# EAGLE schematic ScanMasterVCI (EAGLE 8.4.3)

## Sheet 1 of 2: IC, Power, Connectors
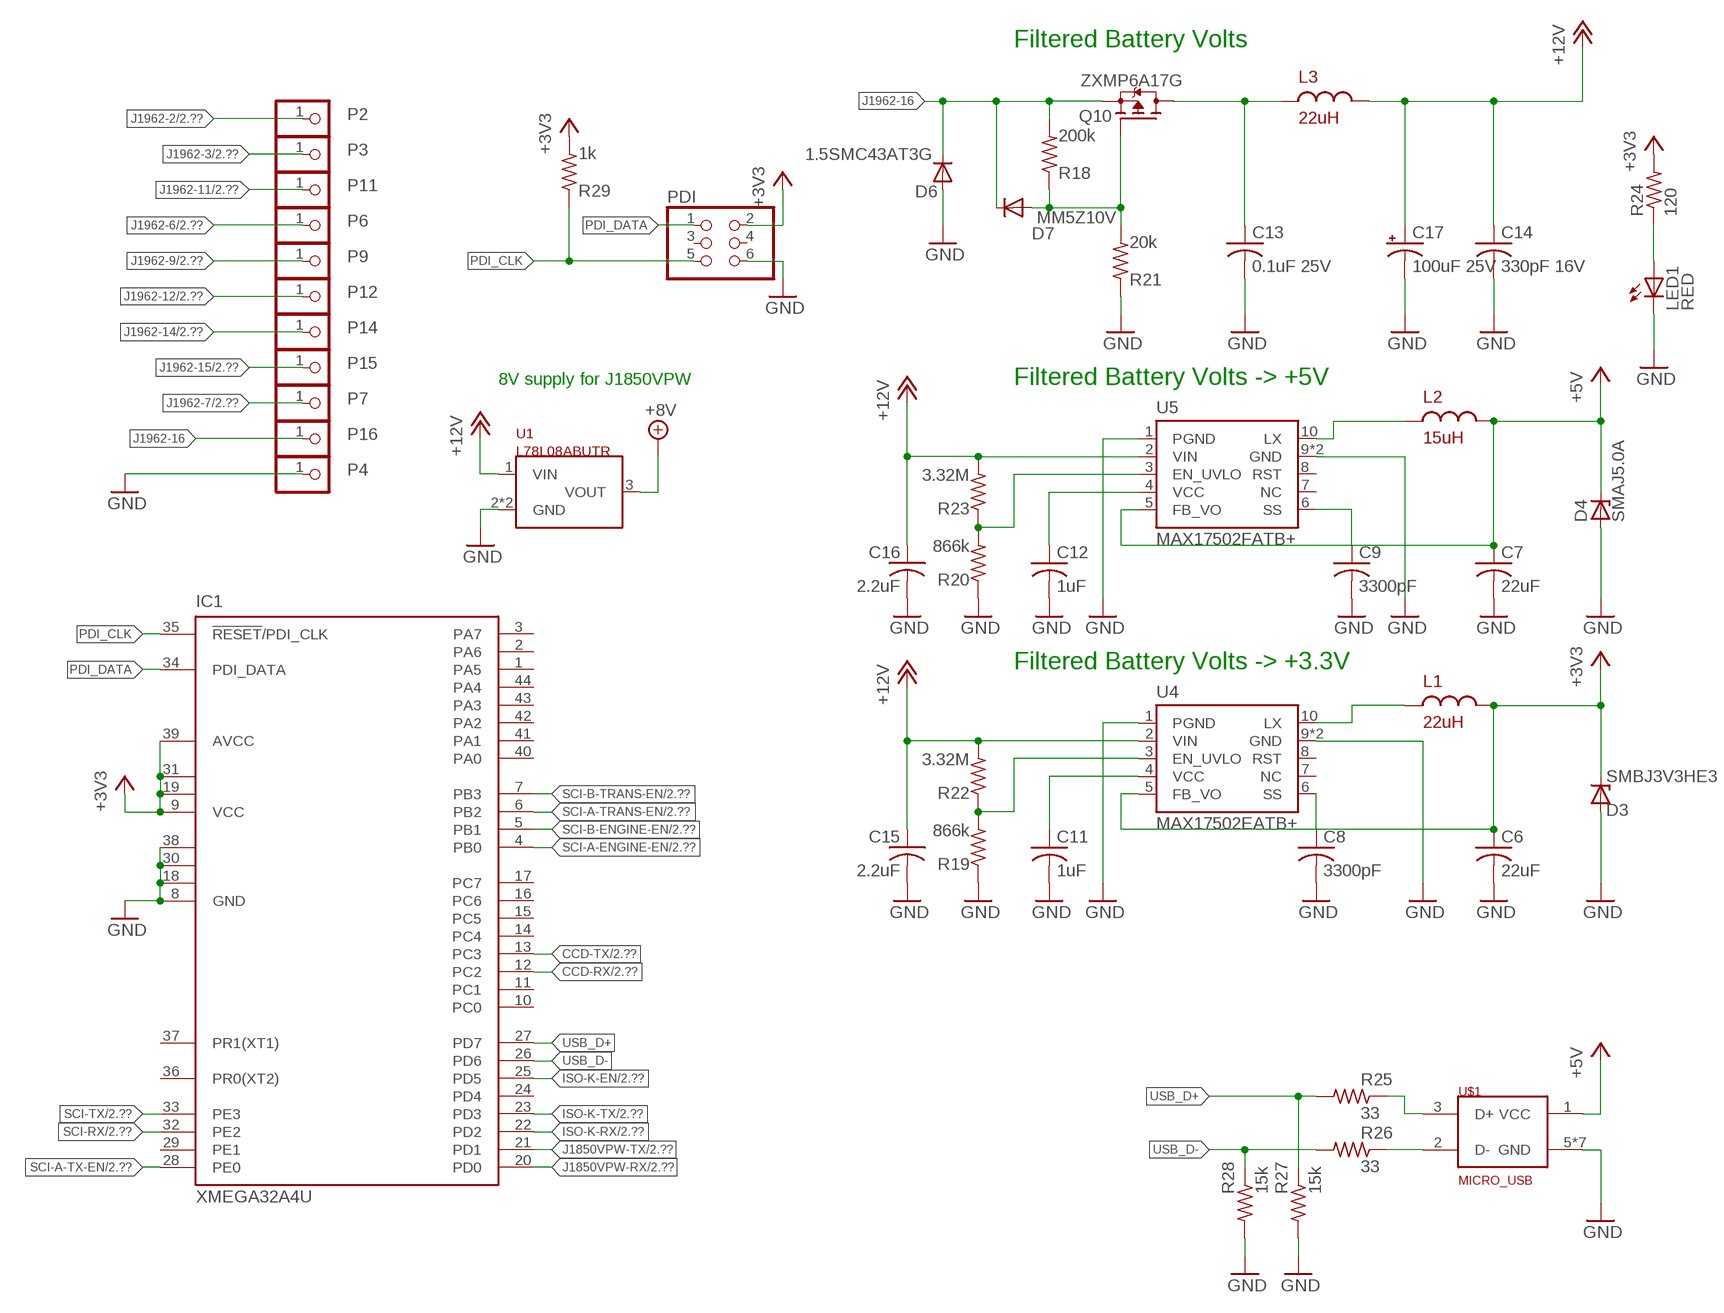
[diagram p0: schematic, sheet 1]

### Parts
C6  22uF  C-USC0603  [C0603]
C7  22uF  C-USC0603  [C0603]
C8  3300pF  C-USC0603  [C0603]
C9  3300pF  C-USC0603  [C0603]
C11  1uF  C-USC0603  [C0603]
C12  1uF  C-USC0603  [C0603]
C13  0.1uF 25V  C-USC0603  [C0603]
C14  330pF 16V  C-USC0603  [C0603]
C15  2.2uF  C-USC0603  [C0603]
C16  2.2uF  C-USC0603  [C0603]
C17  100uF 25V  100UF-POLAR-RADIAL-2.5MM-25V-20%  [CPOL-RADIAL-2.5MM-6.5MM]
D3  SMBJ3V3HE3  ZENER-DIODESMB  [SMB]
D4  SMAJ5.0A  ZENER-DIODESMB  [SMB]
D6  1.5SMC43AT3G  DIODE-SMC  [SMC]
D7  MM5Z10V  DIODE-SOD523  [SOD523]
IC1  XMEGA32A4U  XMEGA16A4A  [TQFP44]
L1  22uH  INDUCTOR  [L0603]
L2  15uH  INDUCTOR  [L0603]
L3  22uH  INDUCTOR  [L0603]
LED1  RED  LEDCHIP-LED0603  [CHIP-LED0603]
P2  PINHD-1X1  [1X01]
P3  PINHD-1X1  [1X01]
P4  PINHD-1X1  [1X01]
P6  PINHD-1X1  [1X01]
P7  PINHD-1X1  [1X01]
P9  PINHD-1X1  [1X01]
P11  PINHD-1X1  [1X01]
P12  PINHD-1X1  [1X01]
P14  PINHD-1X1  [1X01]
P15  PINHD-1X1  [1X01]
P16  PINHD-1X1  [1X01]
PDI  PINHD-2X3  [2X03]
Q10  ZXMP6A17G  [SOT223]
R18  200k  R-US_R0603  [R0603]
R19  866k  R-US_R0603  [R0603]
R20  866k  R-US_R0603  [R0603]
R21  20k  R-US_R0603  [R0603]
R22  3.32M  R-US_R0603  [R0603]
R23  3.32M  R-US_R0603  [R0603]
R24  120  R-US_R0603  [R0603]
R25  33  R-US_R0603  [R0603]
R26  33  R-US_R0603  [R0603]
R27  15k  R-US_R0603  [R0603]
R28  15k  R-US_R0603  [R0603]
R29  1k  R-US_R0603  [R0603]
U1  L78L08ABUTR  L78L  [SOT89]
U4  MAX17502EATB+  MAX17502  [TDFN-10-EP]
U5  MAX17502FATB+  MAX17502  [TDFN-10-EP]
U$1  MICRO_USB  [10118192]

### Nets
+3V3 [+3.3v]: C6.1 D3.C IC1.9(VCC) IC1.19(VCC1) IC1.31(VCC2) IC1.39(AVCC) L1.2 PDI.2 R24.2 R29.2 U4.5(FB_VO) ; also sheet 2
+5V [+5v]: C7.1 D4.C L2.2 U5.5(FB_VO) U$1.1(VCC) ; also sheet 2
+8V [+3.3v]: U1.3(VOUT) ; also sheet 2
+12V [+12v]: C14.1 C15.1 C16.1 C17.1(+) L3.2 R22.2 R23.2 U1.1(VIN) U4.2(VIN) U5.2(VIN) ; also sheet 2
CCD-RX: IC1.12(PC2) ; also sheet 2
CCD-TX: IC1.13(PC3) ; also sheet 2
GND [+12v]: C6.2 C7.2 C8.2 C9.2 C11.2 C12.2 C13.2 C14.2 C15.2 C16.2 C17.2(-) D3.A D4.A D6.A IC1.8(GND) IC1.18(GND1) IC1.30(GND2) IC1.38(GND3) LED1.C P4.1 PDI.6 R19.1 R20.1 R21.1 R27.2 R28.2 U1.2(GND) U1.2@1(GND) U4.1(PGND) U4.9(GND) U4.EPAD(GND) U5.1(PGND) U5.9(GND) U5.EPAD(GND) U$1.5(GND) U$1.M1(GND) U$1.M2(GND) U$1.M3(GND) U$1.M4(GND) U$1.M5(GND) U$1.M6(GND) ; also sheet 2
ISO-K-EN: IC1.25(PD5) ; also sheet 2
ISO-K-RX: IC1.22(PD2) ; also sheet 2
ISO-K-TX: IC1.23(PD3) ; also sheet 2
J1850VPW-RX: IC1.20(PD0) ; also sheet 2
J1850VPW-TX: IC1.21(PD1) ; also sheet 2
J1962-2: P2.1 ; also sheet 2
J1962-3: P3.1 ; also sheet 2
J1962-6: P6.1 ; also sheet 2
J1962-7: P7.1 ; also sheet 2
J1962-9: P9.1 ; also sheet 2
J1962-11: P11.1 ; also sheet 2
J1962-12: P12.1 ; also sheet 2
J1962-14: P14.1 ; also sheet 2
J1962-15: P15.1 ; also sheet 2
J1962-16 [+12v]: D6.C D7.C P16.1 Q10.3(S) R18.2
N$2: LED1.A R24.1
N$3: C8.1 U4.6(SS)
N$7: R19.2 R22.1 U4.3(EN_UVLO)
N$9: C11.1 U4.4(VCC)
N$12 [+3.3v]: L1.1 U4.10(LX)
N$15: C12.1 U5.4(VCC)
N$16: R20.2 R23.1 U5.3(EN_UVLO)
N$17: C9.1 U5.6(SS)
N$18 [+12v]: C13.1 L3.1 Q10.2(D) Q10.4(D)
N$19 [+5v]: L2.1 U5.10(LX)
N$20 [+12v]: D7.A Q10.1(G) R18.1 R21.2
N$24: R25.1 U$1.3(D+)
N$25: R26.1 U$1.2(D-)
PDI_CLK: IC1.35(!RESET!/PDI_CLK) PDI.5 R29.1
PDI_DATA: IC1.34(PDI_DATA) PDI.1
SCI-A-ENGINE-EN: IC1.4(PB0) ; also sheet 2
SCI-A-TRANS-EN: IC1.6(PB2) ; also sheet 2
SCI-A-TX-EN: IC1.28(PE0) ; also sheet 2
SCI-B-ENGINE-EN: IC1.5(PB1) ; also sheet 2
SCI-B-TRANS-EN: IC1.7(PB3) ; also sheet 2
SCI-RX: IC1.32(PE2) ; also sheet 2
SCI-TX: IC1.33(PE3) ; also sheet 2
USB_D+: IC1.27(PD7) R25.2 R27.1
USB_D-: IC1.26(PD6) R26.2 R28.1
Unconnected: IC1.1(PA5) IC1.2(PA6) IC1.3(PA7) IC1.10(PC0) IC1.11(PC1) IC1.14(PC4) IC1.15(PC5) IC1.16(PC6) IC1.17(PC7) IC1.24(PD4) IC1.29(PE1) IC1.36(PR0(XT2)) IC1.37(PR1(XT1)) IC1.40(PA0) IC1.41(PA1) IC1.42(PA2) IC1.43(PA3) IC1.44(PA4) PDI.3 PDI.4 U4.7(NC) U4.8(RST) U5.7(NC) U5.8(RST)

### Notes on the sheet
- Filtered Battery Volts
- 8V supply for J1850VPW | Filtered Battery Volts -> +5V
- Filtered Battery Volts -> +3.3V

## Sheet 2 of 2: Bus Connections, Mux
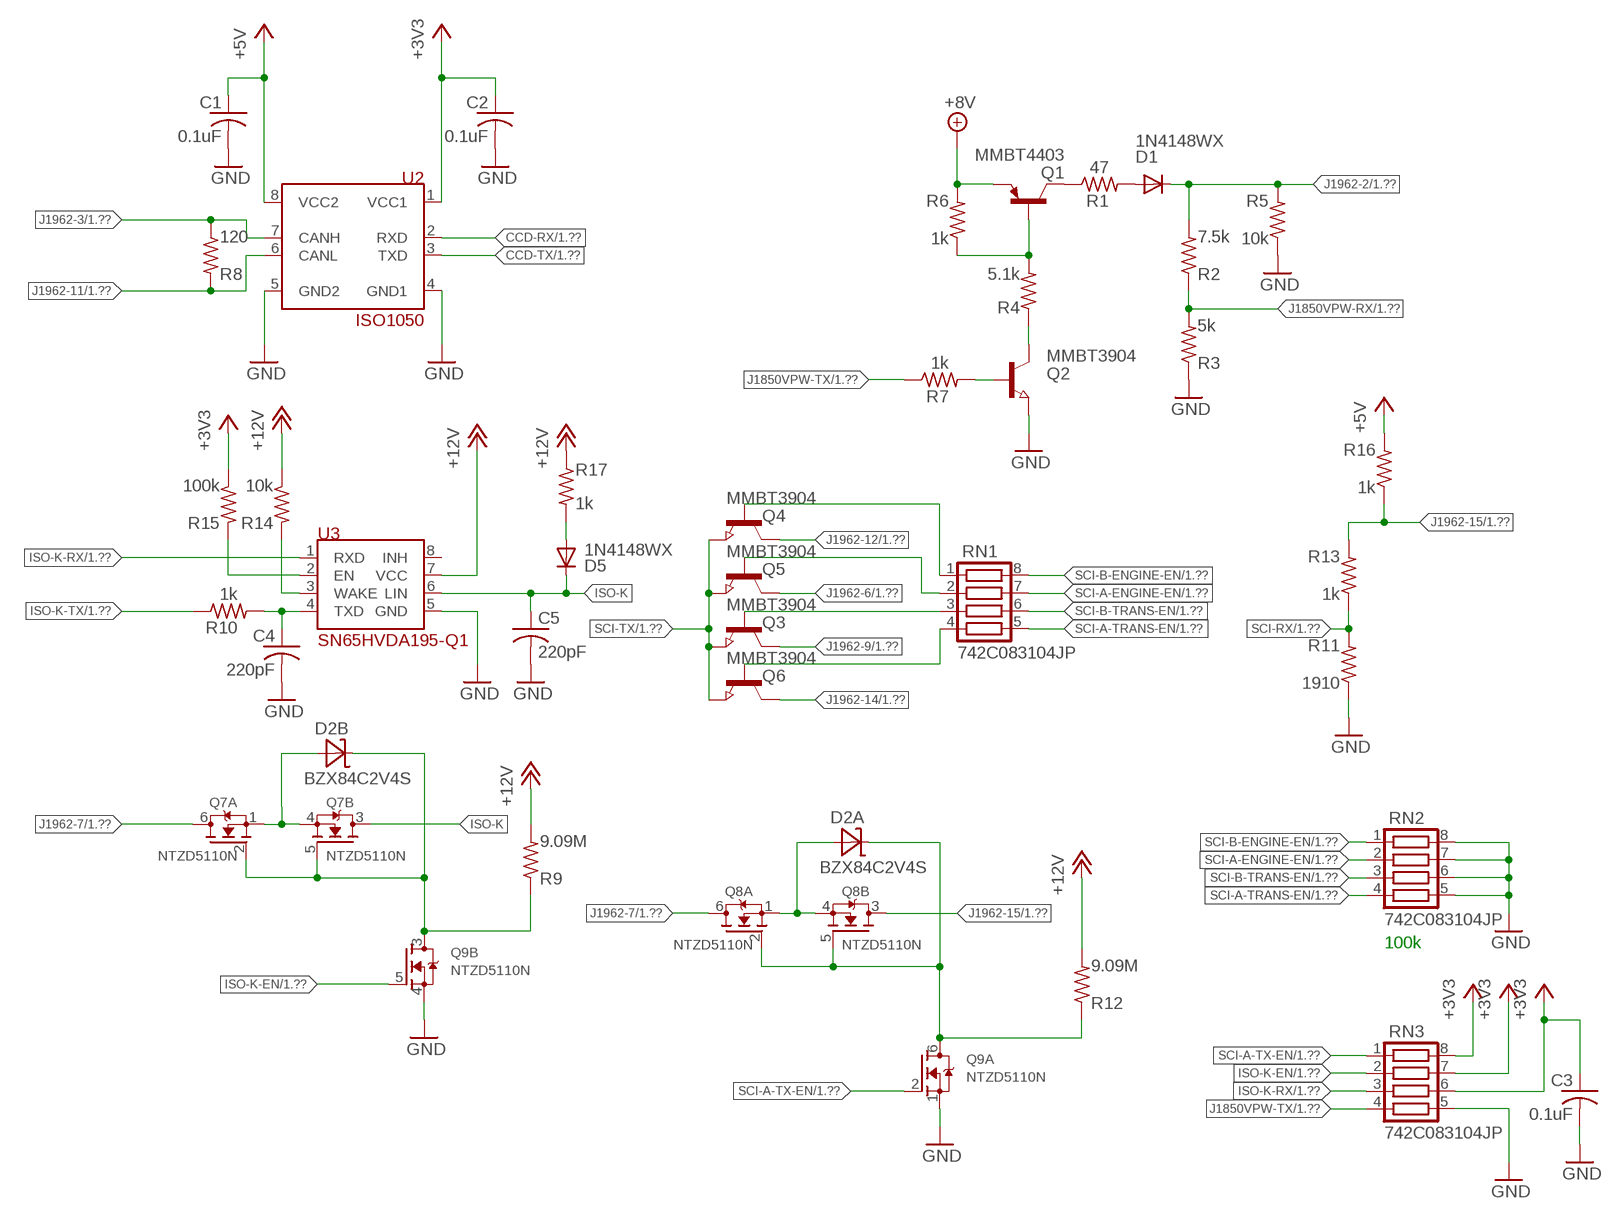
[diagram p1: schematic, sheet 2]

### Parts
C1  0.1uF  C-USC0603  [C0603]
C2  0.1uF  C-USC0603  [C0603]
C3  0.1uF  C-USC0603  [C0603]
C4  220pF  C-USC0603  [C0603]
C5  220pF  C-USC0603  [C0603]
D1  1N4148WX  DIODE-SOD323-R  [SOD323-R]
D2  BZX84C2V4S  [SOT363]
D5  1N4148WX  DIODE-SOD323-R  [SOD323-R]
Q1  MMBT4403  MMBT4403LT1SMD  [SOT23-BEC]
Q2  MMBT3904  NPN-TRANSISTOR_SOT23  [SOT23]
Q3  MMBT3904  NPN-TRANSISTOR_SOT23  [SOT23]
Q4  MMBT3904  NPN-TRANSISTOR_SOT23  [SOT23]
Q5  MMBT3904  NPN-TRANSISTOR_SOT23  [SOT23]
Q6  MMBT3904  NPN-TRANSISTOR_SOT23  [SOT23]
Q7  NTZD5110N  [SOT563]
Q8  NTZD5110N  [SOT563]
Q9  NTZD5110N  [SOT563]
R1  47  R-US_R0603  [R0603]
R2  7.5k  R-US_R0603  [R0603]
R3  5k  R-US_R0603  [R0603]
R4  5.1k  R-US_R0603  [R0603]
R5  10k  R-US_R0603  [R0603]
R6  1k  R-US_R0603  [R0603]
R7  1k  R-US_R0603  [R0603]
R8  120  R-US_R0603  [R0603]
R9  9.09M  R-US_R0603  [R0603]
R10  1k  R-US_R0603  [R0603]
R11  1910  R-US_R0603  [R0603]
R12  9.09M  R-US_R0603  [R0603]
R13  1k  R-US_R0603  [R0603]
R14  10k  R-US_R0603  [R0603]
R15  100k  R-US_R0603  [R0603]
R16  1k  R-US_R0603  [R0603]
R17  1k  R-US_R0603  [R0603]
RN1  742C083104JP  CTS742C083  [CTS742C083]
RN2  742C083104JP  CTS742C083  [CTS742C083]
RN3  742C083104JP  CTS742C083  [CTS742C083]
U2  ISO1050  [SOP08]
U3  SN65HVDA195-Q1  [SO08]

### Nets
+3V3 [+3.3v]: C2.1 C3.1 R15.1 RN3.6 RN3.7 RN3.8 U2.1(VCC1) ; also sheet 1
+5V [+5v]: C1.1 R16.2 U2.8(VCC2) ; also sheet 1
+8V [+3.3v]: Q1.E R6.2 ; also sheet 1
+12V [+12v]: R9.2 R12.2 R14.1 R17.1 U3.7(VCC) ; also sheet 1
CCD-RX: U2.2(RXD) ; also sheet 1
CCD-TX: U2.3(TXD) ; also sheet 1
GND [+12v]: C1.2 C2.2 C3.2 C4.2 C5.2 Q2.2(E) Q9.1(A:S) Q9.4(B:S) R3.1 R5.1 R11.1 RN2.5 RN2.6 RN2.7 RN2.8 RN3.5 U2.4(GND1) U2.5(GND2) U3.5(GND) ; also sheet 1
ISO-K: C5.1 D5.C Q7.3(B:D) U3.6(LIN)
ISO-K-EN: Q9.5(B:G) RN3.2 ; also sheet 1
ISO-K-RX: RN3.3 U3.1(RXD) ; also sheet 1
ISO-K-TX: R10.1 ; also sheet 1
J1850VPW-RX: R2.1 R3.2 ; also sheet 1
J1850VPW-TX: R7.1 RN3.4 ; also sheet 1
J1962-2: D1.C R2.2 R5.2 ; also sheet 1
J1962-3: R8.1 U2.7(CANH) ; also sheet 1
J1962-6: Q5.3(C) ; also sheet 1
J1962-7: Q7.6(A:D) Q8.6(A:D) ; also sheet 1
J1962-9: Q3.3(C) ; also sheet 1
J1962-11: R8.2 U2.6(CANL) ; also sheet 1
J1962-12: Q4.3(C) ; also sheet 1
J1962-14: Q6.3(C) ; also sheet 1
J1962-15: Q8.3(B:D) R13.2 R16.1 ; also sheet 1
N$1: D2.2(A:A) Q8.1(A:S) Q8.4(B:S)
N$4: D2.5(B:A) Q7.1(A:S) Q7.4(B:S)
N$5: D2.3(A:C) Q8.2(A:G) Q8.5(B:G) Q9.6(A:D) R12.1
N$6: Q2.1(B) R7.2
N$8: R15.2 U3.2(EN)
N$10: C4.1 R10.2 U3.4(TXD)
N$11: D2.6(B:C) Q7.2(A:G) Q7.5(B:G) Q9.3(B:D) R9.1
N$13: Q4.1(B) RN1.1
N$14: R14.2 U3.3(WAKE)
N$21: Q5.1(B) RN1.2
N$22: Q3.1(B) RN1.3
N$23: Q6.1(B) RN1.4
N$26: Q2.3(C) R4.1
N$28: Q1.B R4.2 R6.1
N$29: Q1.C R1.1
N$30: D1.A R1.2
N$31: D5.A R17.2
SCI-A-ENGINE-EN: RN1.7 RN2.2 ; also sheet 1
SCI-A-TRANS-EN: RN1.5 RN2.4 ; also sheet 1
SCI-A-TX-EN: Q9.2(A:G) RN3.1 ; also sheet 1
SCI-B-ENGINE-EN: RN1.8 RN2.1 ; also sheet 1
SCI-B-TRANS-EN: RN1.6 RN2.3 ; also sheet 1
SCI-RX: R11.2 R13.1 ; also sheet 1
SCI-TX: Q3.2(E) Q4.2(E) Q5.2(E) Q6.2(E) ; also sheet 1
Unconnected: U3.8(INH)

### Notes on the sheet
- 100k

## Library data of the parts
C1-C9 C11-C16 = adafruit:C-US: CAPACITOR, American symbol
C17 = SparkFun-Capacitors:100UF-POLAR: 100µF polarized capacitors A capacitor is a passive two-terminal electrical component used to store electrical energy temporarily in an electric field.; PROD_ID: CAP-08439; VALUE: 100uF
D1 D5-D7 = diode:DIODE-: DIODE
D2 = customics:BZX84C2V4S: DUAL 200mW SURFACE MOUNT ZENER DIODE Source: https://www.diodes.com/assets/Datasheets/ds30108.pdf
D3 D4 = diode:ZENER-DIODE: Z-Diode
IC1 = atmel:XMEGA16A4: MICROCONTROLLER Features High-performance, Low-power 8/16-bit AVR XMEGA Microcontroller Non-Volatile Program and Data Memories - 16 KB - 128 KB of In-System Self-Programmable Flash - 4 KB - 8 KB Boot Code Section with Independent Lock Bits - 1 KB - 2 KB EEPROM - 2 KB - 8 KB Internal SRAM Peripheral Features - Four-channel DMA Controller with support for external requests - Eight-channel Event System - Five 16-bit Timer/Counters Three Timer/Counters with 4 Output Compare or Input Capture channels Two Timer/Counters with 2 Output Compare or Input Capture channels High-Resolution Extensions on all Timer/Counters Advanced Waveform Extension on one Timer/Counter - Five USARTs IrDA Extension on one USART - Two Two-Wire Interfaces with dual address match (I2C and SMBus compatible) - Two SPIs (Serial Peripheral Interfaces) peripherals - AES and DES Crypto Engine - 16-bit Real Time Counter with Separate Oscillator - One Twelve-channel, 12-bit, 2 Msps Analog to Digital Converter - One Two-channel, 12-bit, 1 Msps Digital to Analog Converter - Two Analog Comparators with Window compare function - External Interrupts on all General Purpose I/O pins - Programmable Watchdog Timer with Separate On-chip Ultra Low Power Oscillator Special Microcontroller Features - Power-on Reset and Programmable Brown-out Detection - Internal and External Clock Options with PLL - Programmable Multi-level Interrupt Controller - Sleep Modes: Idle, Power-down, Standby, Power-save, Extended Standby - Advanced Programming, Test and Debugging Interfaces PDI (Program and Debug Interface) for programming, test and debugging I/O and Packages - 34 Programmable I/O Lines - 44 - lead TQFP - 44 - pad VQFN/QFN - 49 - ball VFBGA Operating Voltage - 1.6 - 3.6V Speed performance - 0 - 12 MHz @ 1.6 - 3.6V - 0 - 32 MHz @ 2.7 - 3.6V Drawn by Dipl.-Ing. (FH) Robert Siegler Created: 27.05.09; OC_FARNELL: unknown; OC_NEWARK: unknown
L1-L3 = customics:INDUCTOR: Generic Inductor in SMD
LED1 = led:LED: LED OSRAM: - CHIPLED LG R971, LG N971, LY N971, LG Q971, LY Q971, LO R971, LY R971 LH N974, LH R974 LS Q976, LO Q976, LY Q976 LO Q996 - Hyper CHIPLED LW Q18S LB Q993, LB Q99A, LB R99A - SideLED LS A670, LO A670, LY A670, LG A670, LP A670 LB A673, LV A673, LT A673, LW A673 LH A674 LY A675 LS A676, LA A676, LO A676, LY A676, LW A676 LS A679, LY A679, LG A679 - Hyper Micro SIDELED® LS Y876, LA Y876, LO Y876, LY Y876 LT Y87S - SmartLED LW L88C, LW L88S LB L89C, LB L89S, LG L890 LS L89K, LO L89K, LY L89K LS L896, LA L896, LO L896, LY L896 - TOPLED LS T670, LO T670, LY T670, LG T670, LP T670 LSG T670, LSP T670, LSY T670, LOP T670, LYG T670 LG T671, LOG T671, LSG T671 LB T673, LV T673, LT T673, LW T673 LH T674 LS T676, LA T676, LO T676, LY T676, LB T676, LH T676, LSB T676, LW T676 LB T67C, LV T67C, LT T67C, LS T67K, LO T67K, LY T67K, LW E67C LS E67B, LA E67B, LO E67B, LY E67B, LB E67C, LV E67C, LT E67C LW T67C LS T679, LY T679, LG T679 LS T770, LO T770, LY T770, LG T770, LP T770 LB T773, LV T773, LT T773, LW T773 LH T774 LS E675, LA E675, LY E675, LS T675 LS T776, LA T776, LO T776, LY T776, LB T776 LHGB T686 LT T68C, LB T68C - Hyper Mini TOPLED® LB M676 - Mini TOPLED Santana® LG M470 LS M47K, LO M47K, LY M47K Source: http://www.osram.convergy.de LUXEON: - LUMILED® LXK2-PW12-R00, LXK2-PW12-S00, LXK2-PW14-U00, LXK2-PW14-V00 LXK2-PM12-R00, LXK2-PM12-S00, LXK2-PM14-U00 LXK2-PE12-Q00, LXK2-PE12-R00, LXK2-PE12-S00, LXK2-PE14-T00, LXK2-PE14-U00 LXK2-PB12-K00, LXK2-PB12-L00, LXK2-PB12-M00, LXK2-PB14-N00, LXK2-PB14-P00, LXK2-PB14-Q00 LXK2-PR12-L00, LXK2-PR12-M00, LXK2-PR14-Q00, LXK2-PR14-R00 LXK2-PD12-Q00, LXK2-PD12-R00, LXK2-PD12-S00 LXK2-PH12-R00, LXK2-PH12-S00 LXK2-PL12-P00, LXK2-PL12-Q00, LXK2-PL12-R00 Source: www.luxeon.com KINGBRIGHT: KA-3528ASYC Source: www.kingbright.com
P2-P4 P6 P7 P9 P11 P12 P14-P16 = pinhead:PINHD-1X1: PIN HEADER
PDI = pinhead:PINHD-2X3: PIN HEADER
Q1 = transistor-pnp:MMBT4403*: PNP Transistror
Q2-Q6 = semicon-smd-ipc:NPN-TRANSISTOR_: NPN TRANSISTOR
Q7-Q9 = customics:NTZD5110N: Small Signal MOSFET 60 V, 310 mA, Dual N−Channel with ESD Protection, SOT−563 Source: http://www.onsemi.com/pub/Collateral/NTZD5110N-D.PDF
Q10 = customics:ZXMP6A17G
R1-R23 R25-R29 = adafruit:R-US_: RESISTOR, American symbol
R24 = resistor:R-US_: RESISTOR, American symbol
RN1-RN3 = resistor-net:CTS742C083: Chip Resistor Array 4 Single Resistor Source: http://www.ctscorp.com/components/Datasheets/CTSChipArrayDs.pdf; OC_FARNELL: unknown; OC_NEWARK: unknown
U1 = customics:L78L: Positive voltage regulators Source: http://www.mouser.com/ds/2/389/l78l-974102.pdf
U2 = customics:ISO1050: Isolated CAN Transceiver Source: http://www.ti.com/lit/ds/symlink/iso1050.pdf
U3 = customics:SN65HVDA195-Q1: LIN(ISO9141) and Most ECL Physical Interface Source: http://www.ti.com/lit/ds/symlink/sn65hvda195-q1.pdf
U4 U5 = customics:MAX17502: 60V, 1A, Ultra-Small, High-Efficiency, Synchronous Step-Down DC-DC Converter (3.3V output) Source: https://datasheets.maximintegrated.com/en/ds/MAX17502.pdf
U$1 = customics:MICRO_USB: Micro-USB Connector Source: https://cdn.amphenol-icc.com/media/wysiwyg/files/drawing/10118192.pdf

## Net classes
0 default: width 0.152 mm, drill 0.305 mm, clearance 0.152 mm
1 +12v: width 0.305 mm, drill 0.305 mm, clearance 0.152 mm
2 +3.3v: width 0.254 mm, drill 0.305 mm, clearance 0.152 mm
3 +5v: width 0.254 mm, drill 0.305 mm, clearance 0.152 mm